# Altium schematic sheet PowerDistribution.SchDoc (part 3 of 3)
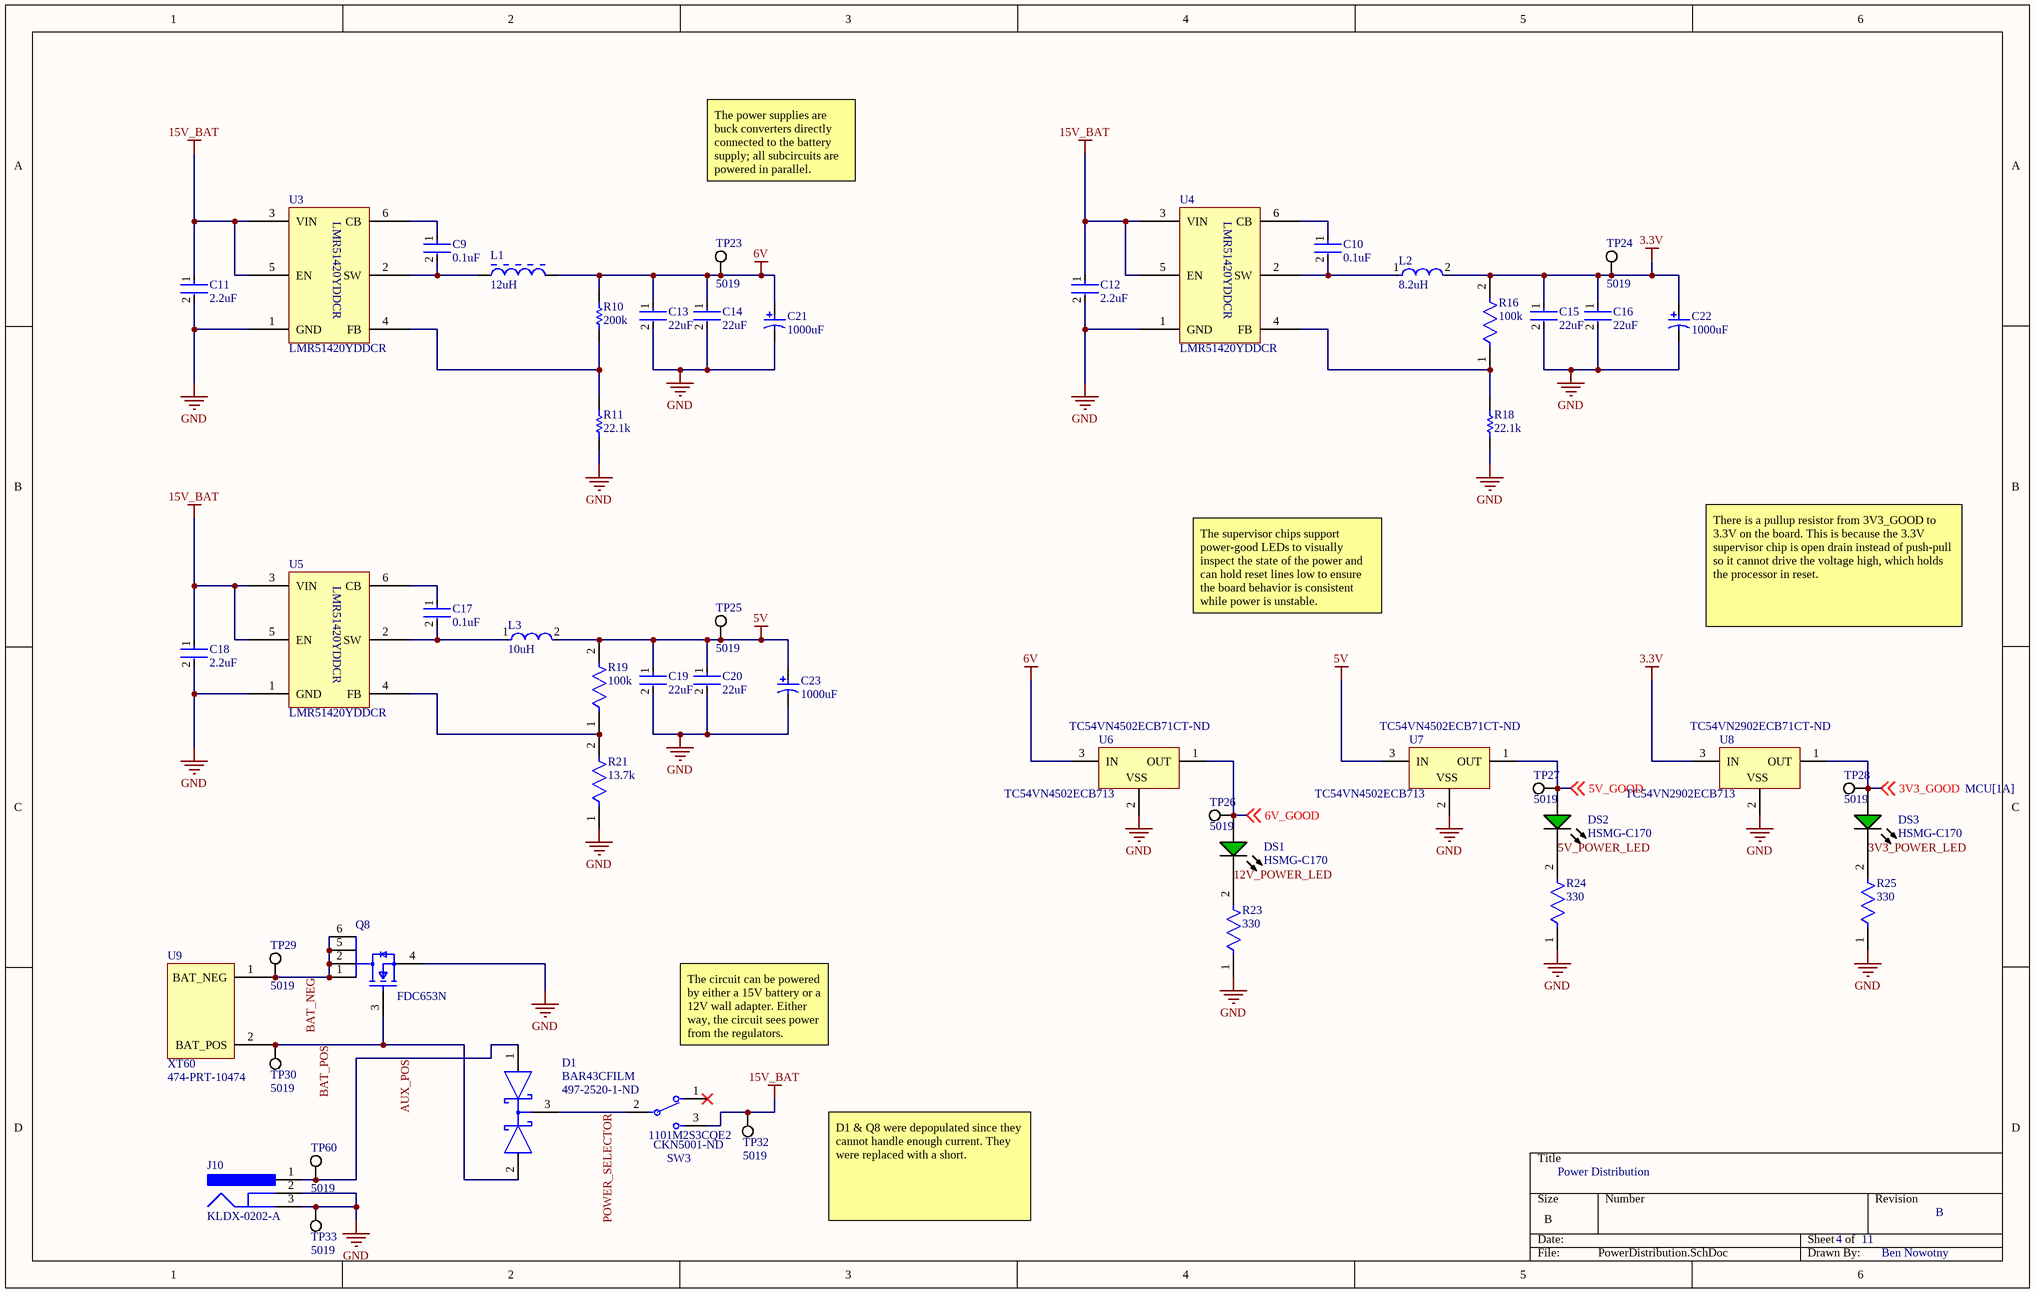
[diagram p2: PowerDistribution.SchDoc]

## Library data of the parts (continued)
U8 = CMP-0130-00067-1: 1Î¼A Voltage Detector, Open-Drain Output, 2.9V, 3-Pin SOT-23A, Industrial Temperature, Tape and Reel; Manufacturer: Microchip; Package Body Material: Plastic; Adjustable Threshold: No; Analog IC - Other Type: POWER SUPPLY SUPPORT CIRCUIT; Number of Channels: 1; Package Equivalence Code: TO-236; Power Supplies: 0.7/10V; Supply Current-Max (Isup): 4uA; Supply Voltage-Max (Vsup): 10V; Supply Voltage-Min (Vsup): 700mV; Supply Voltage-Nom (Vsup): 2V; Time @ Peak Reflow Temperature-Max (s): 40s; Qualification Status: Not Qualified; PackageVersion: revBB, Aug-2009; PackageDescription: 3-Lead Plastic Small Outline Transistor (CB) [SOT-23A]; PackageReference: SOT-23A-CB3; DatasheetVersion: revH, Dec-2007; Supplier 1: Digi-Key; Manufacturer Part Number: TC54VN2902ECB713; RoHS: Yes; Category: Voltage Supervisors; Stock 1: 5363; Pricing 1: 1=0.68000, 25=0.57240, 100=0.51940 (USD); Package Code: LSSOP; Number of Pins: 3; Package Shape: Rectangular; Terminal Finish: Tin; Min Operating Temperature: -40°C; Max Operating Temperature: 85°C; JESD-609 Code: e3; JESD-30 Code: R-PDSO-G3; Number of Functions: 1; Package Style: SMALL OUTLINE, LOW PROFILE, SHRINK PITCHMeter; Surface Mount: Yes; Technology: CMOS; Terminal Form: Gull Wing; Terminal Position: DUAL; Threshold Voltage-Nom: 2.9V; Moisture Sensitivity Level: 1; Peak Reflow Temperature (Cel): 260°C; Length: 2.9mm; Width: 1.5mm; Terminal Pitch: 0.95mm; Height - Seated (Max): 1.45mm; Temperature Grade: INDUSTRIAL; Reach SVHC Compliant: Yes; RoHS Compliant: Yes; ComponentLink1URL: https://datasheet.ciiva.com:443/pdfs/VipMasterIC/IC/MCHP/MCHPS05695/MCHPS05695-1.pdf?src-supplier=IHS+Markit; ComponentLink1Description: https://datasheet.ciiva.com:443/pdfs/VipMasterIC/IC/MCHP/MCHPS05695/MCHPS05695-1.pdf?src-supplier=IHS+Markit; ComponentLink2URL: https://datasheet.ciiva.com/5696/1669371-5696256.pdf?src-supplier=Farnell; ComponentLink2Description: https://datasheet.ciiva.com/5696/1669371-5696256.pdf?src-supplier=Farnell; ComponentLink3URL: https://datasheet.ciiva.com/41463/001085657-da-01-en-ic-volt-det-tc54vn2902ecb713-t23a-so-mcp-41463339.pdf?src-supplier=Conrad; ComponentLink3Description: https://datasheet.ciiva.com/41463/001085657-da-01-en-ic-volt-det-tc54vn2902ecb713-t23a-so-mcp-41463339.pdf?src-supplier=Conrad; ComponentLink4URL: https://datasheet.ciiva.com/1969/filehandler-aspxddocname-en011681-1969686.pdf?src-supplier=Digi-Key; ComponentLink4Description: https://datasheet.ciiva.com/1969/filehandler-aspxddocname-en011681-1969686.pdf?src-supplier=Digi-Key; ComponentLink5URL: https://datasheet.ciiva.com/1969/filehandler-aspxddocname-en011681-1969687.pdf?src-supplier=Digi-Key; ComponentLink5Description: https://datasheet.ciiva.com/1969/filehandler-aspxddocname-en011681-1969687.pdf?src-supplier=Digi-Key; ComponentLink6URL: https://datasheet.ciiva.com/1969/filehandler-aspxddocname-en011681-1969688.pdf?src-supplier=Digi-Key; ComponentLink6Description: https://datasheet.ciiva.com/1969/filehandler-aspxddocname-en011681-1969688.pdf?src-supplier=Digi-Key; ComponentLink7URL: https://datasheet.ciiva.com/9215/jp011681-9215513.pdf?src-supplier=Avnet; ComponentLink7Description: https://datasheet.ciiva.com/9215/jp011681-9215513.pdf?src-supplier=Avnet; ComponentLink8URL: https://datasheet.ciiva.com/7990/1669371-7990742.pdf?src-supplier=Element14; ComponentLink8Description: https://datasheet.ciiva.com/7990/1669371-7990742.pdf?src-supplier=Element14; ComponentLink9URL: https://datasheet.ciiva.com/16493/21434j-16493529.pdf?src-supplier=Future+Electronics; ComponentLink9Description: https://datasheet.ciiva.com/16493/21434j-16493529.pdf?src-supplier=Future+Electronics; ComponentLink10URL: https://datasheet.ciiva.com/8132/jp011681-8132988.pdf?src-supplier=Avnet; ComponentLink10Description: https://datasheet.ciiva.com/8132/jp011681-8132988.pdf?src-supplier=Avnet
U9 = XT60: XT60 Connectors Male/female Pair; Manufacturer: SparkFun; Manufacturer Part Number: PRT-10474; Supplier 1: Mouser; RoHS: No; Category: Headers and Wire Housings; Stock 1: 1468; Pricing 1: 1=1.50000, 10=1.50000, 50=1.50000, 100=1.50000, 1000=1.50000, 10000=1.50000 (USD); ComponentLink1URL: https://cdn.sparkfun.com/datasheets/Prototyping/xt60.pdf?src-supplier=Digi-Key; ComponentLink1Description: https://cdn.sparkfun.com/datasheets/Prototyping/xt60.pdf?src-supplier=Digi-Key